# Altium project Sandbox.PrjPcb
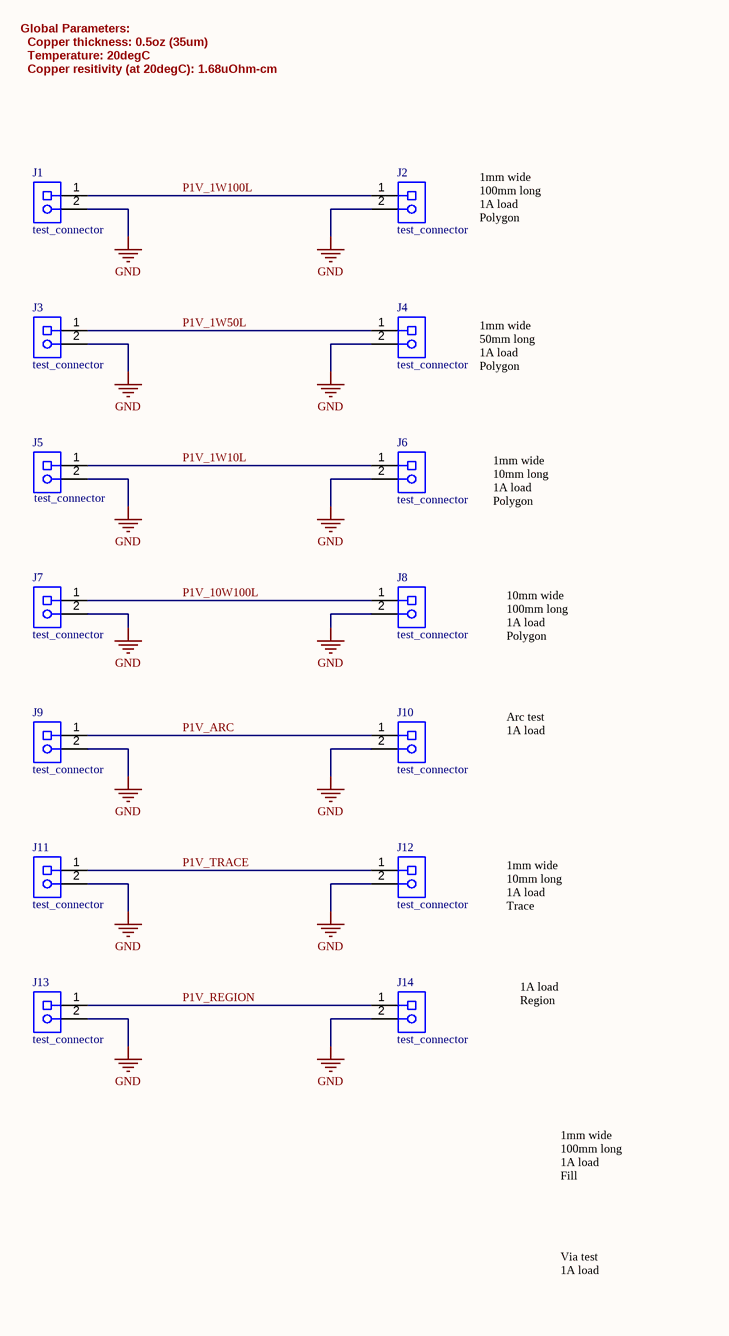
[diagram p0: Main.SchDoc]
1 sheet, 14 parts. Net scope: global (net labels, ports and power ports of the same name join across sheets).
Board file: Sandbox.PcbDoc

## Sheet Main.SchDoc
size A2; ENG_APP_DATE: --/--/--; DSN_APP_DATE: --/--/--; CHK_APP_DATE: --/--/--; SheetNumber: 1; SheetTotal: 1

### Parts
J1  test_connector  [test_connector_footprint]
J2  test_connector  [test_connector_footprint]
J3  test_connector  [test_connector_footprint]
J4  test_connector  [test_connector_footprint]
J5  test_connector  [test_connector_footprint]
J6  test_connector  [test_connector_footprint]
J7  test_connector  [test_connector_footprint]
J8  test_connector  [test_connector_footprint]
J9  test_connector  [test_connector_footprint]
J10  test_connector  [test_connector_footprint]
J11  test_connector  [test_connector_footprint]
J12  test_connector  [test_connector_footprint]
J13  test_connector  [test_connector_footprint]
J14  test_connector  [test_connector_footprint]

### Nets
GND: J1.2 J2.2 J3.2 J4.2 J5.2 J6.2 J7.2 J8.2 J9.2 J10.2 J11.2 J12.2 J13.2 J14.2
P1V_1W10L: J5.1 J6.1
P1V_1W50L: J3.1 J4.1
P1V_1W100L: J1.1 J2.1
P1V_10W100L: J7.1 J8.1
P1V_ARC: J9.1 J10.1
P1V_REGION: J13.1 J14.1
P1V_TRACE: J11.1 J12.1

### Notes on the sheet
- Global Parameters:
  Copper thickness: 0.5oz (35um)
  Temperature: 20degC
  Copper resitivity (at 20degC): 1.68uOhm-cm
- 1mm wide
  100mm long
  1A load
  Polygon
- 1mm wide
  50mm long
  1A load
  Polygon
- 1mm wide
  10mm long
  1A load
  Polygon
- 10mm wide
  100mm long
  1A load
  Polygon
- Arc test
  1A load
- 1mm wide
  10mm long
  1A load
  Trace
- 1A load
  Region
- 1mm wide
  100mm long
  1A load
  Fill
- Via test
  1A load
- DWG NO:
- REV:
- THIS DOCUMENT AND THE DATA DISCLOSED HEREIN OR
- HEREWITH IS THE PROPERTY OF ALTIUM LIMITED AND MAY
- BE FREELY DISTRIBUTED IN WHOLE. NO RIGHTS ARE
- RESERVED OR EXPRESS OR IMPLIED WARANTEE GIVEN.
- REVISION
- DESCRIPTION
- DATE
- APPROVED
- ENG:
- APPROVALS
- PROJECT
- DSN:
- CHK:
- REFERENCE DOCUMENTS
- PROJECT REVISION:
- TITLE
- DOCUMENT REVISION:
- DESIGN ITEM:
- BOM:
- FAB DWG:
- PCB DWG:
- ASSY DWG:
- SCALE:
- A2
- SIZE
- CAGE CODE
- FILE NAME
- DWG NO.
- SHEET
- OF
- REV

### Library data of the parts
J1 = test_conn: for playing around with; Manufacturer: Phoenix Contact; Manufacturer Part Number: 1729128; PDN_ROLE: SOURCE; PDN_P_NET: P1V_1W100L; PDN_N_NET: GND; PDN_V: 1; Component Type: Connectors
J2 = test_conn: for playing around with; Manufacturer: Phoenix Contact; Manufacturer Part Number: 1729128; PDN_ROLE: SINK; PDN_I: 1; PDN_P_NET: P1V_1W100L; PDN_N_NET: GND; Component Type: Connectors
J3 = test_conn: for playing around with; Manufacturer: Phoenix Contact; Manufacturer Part Number: 1729128; PDN_ROLE: SOURCE; PDN_P_NET: P1V_1W50L; PDN_N_NET: GND; PDN_V: 1; Component Type: Connectors
J4 = test_conn: for playing around with; Manufacturer: Phoenix Contact; Manufacturer Part Number: 1729128; PDN_ROLE: SINK; PDN_I: 1; PDN_P_NET: P1V_1W50L; PDN_N_NET: GND; Component Type: Connectors
J5 = test_conn: for playing around with; Manufacturer: Phoenix Contact; Manufacturer Part Number: 1729128; PDN_ROLE: SOURCE; PDN_P_NET: P1V_1W10L; PDN_N_NET: GND; PDN_V: 1; Component Type: Connectors
J6 = test_conn: for playing around with; Manufacturer: Phoenix Contact; Manufacturer Part Number: 1729128; PDN_ROLE: SINK; PDN_I: 1; PDN_P_NET: P1V_1W10L; PDN_N_NET: GND; Component Type: Connectors
J7 = test_conn: for playing around with; Manufacturer: Phoenix Contact; Manufacturer Part Number: 1729128; PDN_ROLE: SOURCE; PDN_P_NET: P1V_10W100L; PDN_N_NET: GND; PDN_V: 1; Component Type: Connectors
J8 = test_conn: for playing around with; Manufacturer: Phoenix Contact; Manufacturer Part Number: 1729128; PDN_ROLE: SINK; PDN_I: 1; PDN_P_NET: P1V_10W100L; PDN_N_NET: GND; Component Type: Connectors
J9 = test_conn: for playing around with; Manufacturer: Phoenix Contact; Manufacturer Part Number: 1729128; PDN_ROLE: SOURCE; PDN_P_NET: P1V_ARC; PDN_N_NET: GND; PDN_V: 1; Component Type: Connectors
J10 = test_conn: for playing around with; Manufacturer: Phoenix Contact; Manufacturer Part Number: 1729128; PDN_ROLE: SINK; PDN_I: 1; PDN_P_NET: P1V_ARC; PDN_N_NET: GND; Component Type: Connectors
J11 = test_conn: for playing around with; Manufacturer: Phoenix Contact; Manufacturer Part Number: 1729128; PDN_ROLE: SOURCE; PDN_P_NET: P1V_TRACE; PDN_N_NET: GND; PDN_V: 1; Component Type: Connectors
J12 = test_conn: for playing around with; Manufacturer: Phoenix Contact; Manufacturer Part Number: 1729128; PDN_ROLE: SINK; PDN_I: 1; PDN_P_NET: P1V_TRACE; PDN_N_NET: GND; Component Type: Connectors
J13 = test_conn: for playing around with; Manufacturer: Phoenix Contact; Manufacturer Part Number: 1729128; PDN_ROLE: SOURCE; PDN_P_NET: P1V_REGION; PDN_N_NET: GND; PDN_V: 1; Component Type: Connectors
J14 = test_conn: for playing around with; Manufacturer: Phoenix Contact; Manufacturer Part Number: 1729128; PDN_ROLE: SINK; PDN_I: 1; PDN_P_NET: P1V_REGION; PDN_N_NET: GND; Component Type: Connectors

## Assembly variants
Bringup: all parts fitted